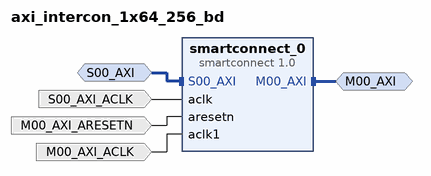
[diagram p0: block diagram of the top level]
# Vivado block design axi_intercon_1x64_256_bd, xc7k410tffg900-2, Vivado 2017.4
create_bd_design axi_intercon_1x64_256_bd

create_bd_intf_port -mode Master -vlnv xilinx.com:interface:aximm_rtl:1.0 M00_AXI
set_property -dict [list \
  CONFIG.DATA_WIDTH 256 \
  CONFIG.PROTOCOL AXI4 \
  CONFIG.FREQ_HZ 150000000 \
  CONFIG.ADDR_WIDTH 32 \
  CONFIG.NUM_READ_OUTSTANDING 2 \
  CONFIG.NUM_WRITE_OUTSTANDING 2 \
  CONFIG.CLK_DOMAIN axi_intercon_1x64_256_bd_M00_ACLK \
] [get_bd_intf_ports M00_AXI]
create_bd_intf_port -mode Slave -vlnv xilinx.com:interface:aximm_rtl:1.0 S00_AXI
set_property -dict [list \
  CONFIG.DATA_WIDTH 64 \
  CONFIG.PROTOCOL AXI4 \
  CONFIG.FREQ_HZ 300000000 \
  CONFIG.ID_WIDTH 1 \
  CONFIG.ADDR_WIDTH 32 \
  CONFIG.AWUSER_WIDTH 0 \
  CONFIG.ARUSER_WIDTH 0 \
  CONFIG.WUSER_WIDTH 0 \
  CONFIG.RUSER_WIDTH 0 \
  CONFIG.BUSER_WIDTH 0 \
  CONFIG.READ_WRITE_MODE READ_WRITE \
  CONFIG.HAS_BURST 1 \
  CONFIG.HAS_LOCK 1 \
  CONFIG.HAS_PROT 1 \
  CONFIG.HAS_CACHE 1 \
  CONFIG.HAS_QOS 1 \
  CONFIG.HAS_REGION 0 \
  CONFIG.HAS_WSTRB 1 \
  CONFIG.HAS_BRESP 1 \
  CONFIG.HAS_RRESP 1 \
  CONFIG.SUPPORTS_NARROW_BURST 1 \
  CONFIG.NUM_READ_OUTSTANDING 2 \
  CONFIG.NUM_WRITE_OUTSTANDING 2 \
  CONFIG.MAX_BURST_LENGTH 256 \
  CONFIG.CLK_DOMAIN axi_intercon_1x64_256_bd_S00_ACLK \
  CONFIG.NUM_READ_THREADS 1 \
  CONFIG.NUM_WRITE_THREADS 1 \
  CONFIG.RUSER_BITS_PER_BYTE 0 \
  CONFIG.WUSER_BITS_PER_BYTE 0 \
  CONFIG.master_id 0 \
] [get_bd_intf_ports S00_AXI]
create_bd_port -dir I -type clk S00_AXI_ACLK
set_property -dict [list \
  CONFIG.FREQ_HZ 300000000 \
  CONFIG.CLK_DOMAIN axi_intercon_1x64_256_bd_S00_ACLK \
  CONFIG.ASSOCIATED_BUSIF S00_AXI \
  CONFIG.ASSOCIATED_RESET S00_AXI_ARESETN \
] [get_bd_ports S00_AXI_ACLK]
create_bd_port -dir I -type rst M00_AXI_ARESETN
create_bd_port -dir I -type clk M00_AXI_ACLK
set_property -dict [list \
  CONFIG.FREQ_HZ 150000000 \
  CONFIG.CLK_DOMAIN axi_intercon_1x64_256_bd_M00_ACLK \
  CONFIG.ASSOCIATED_BUSIF M00_AXI \
  CONFIG.ASSOCIATED_RESET M00_AXI_ARESETN \
] [get_bd_ports M00_AXI_ACLK]

create_bd_cell -type ip -vlnv xilinx.com:ip:smartconnect:1.0 smartconnect_0
set_property -dict {CONFIG.NUM_SI 1 CONFIG.NUM_CLKS 2} [get_bd_cells smartconnect_0]

# ---- connections ----

connect_bd_intf_net [get_bd_intf_ports M00_AXI] [get_bd_intf_pins smartconnect_0/M00_AXI]
connect_bd_intf_net -intf_net S00_AXI_0_1 [get_bd_intf_ports S00_AXI] [get_bd_intf_pins smartconnect_0/S00_AXI]
connect_bd_net [get_bd_ports S00_AXI_ACLK] [get_bd_pins smartconnect_0/aclk]
connect_bd_net [get_bd_ports M00_AXI_ARESETN] [get_bd_pins smartconnect_0/aresetn]
connect_bd_net [get_bd_ports M00_AXI_ACLK] [get_bd_pins smartconnect_0/aclk1]

# ---- address map ----
assign_bd_address -offset 0x00000000 -range 1G -target_address_space [get_bd_addr_spaces S00_AXI] [get_bd_addr_segs M00_AXI/Reg]

validate_bd_design
save_bd_design
